# EAGLE schematic leds (EAGLE 7.7.0)
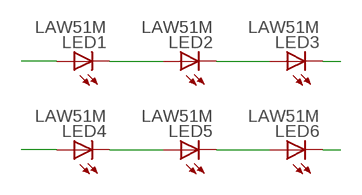
[diagram p0: schematic, sheet 1]

## Parts
LED1  LAW51M  [W51]
LED2  LAW51M  [W51]
LED3  LAW51M  [W51]
LED4  LAW51M  [W51]
LED5  LAW51M  [W51]
LED6  LAW51M  [W51]

## Nets
N$1: LED1.C LED2.A
N$2: LED4.C LED5.A
N$3: LED2.C LED3.A
N$4: LED5.C LED6.A
N$5: LED1.A
N$6: LED4.A
N$7: LED6.C
N$8: LED3.C
Unconnected: LED1.TH@1(TH) LED1.TH@2(TH) LED1.TH@3(TH) LED2.TH@1(TH) LED2.TH@2(TH) LED2.TH@3(TH) LED3.TH@1(TH) LED3.TH@2(TH) LED3.TH@3(TH) LED4.TH@1(TH) LED4.TH@2(TH) LED4.TH@3(TH) LED5.TH@1(TH) LED5.TH@2(TH) LED5.TH@3(TH) LED6.TH@1(TH) LED6.TH@2(TH) LED6.TH@3(TH)

## Library data of the parts
LED1-LED6 = led:*W51M: Golden DRAGON® with Lens Enhanced Thinfilm LED Source: LA_LR_LY_W51M_Pb_free[1].pdf